# EAGLE design Root_v1.01 (EAGLE 7.6.0)
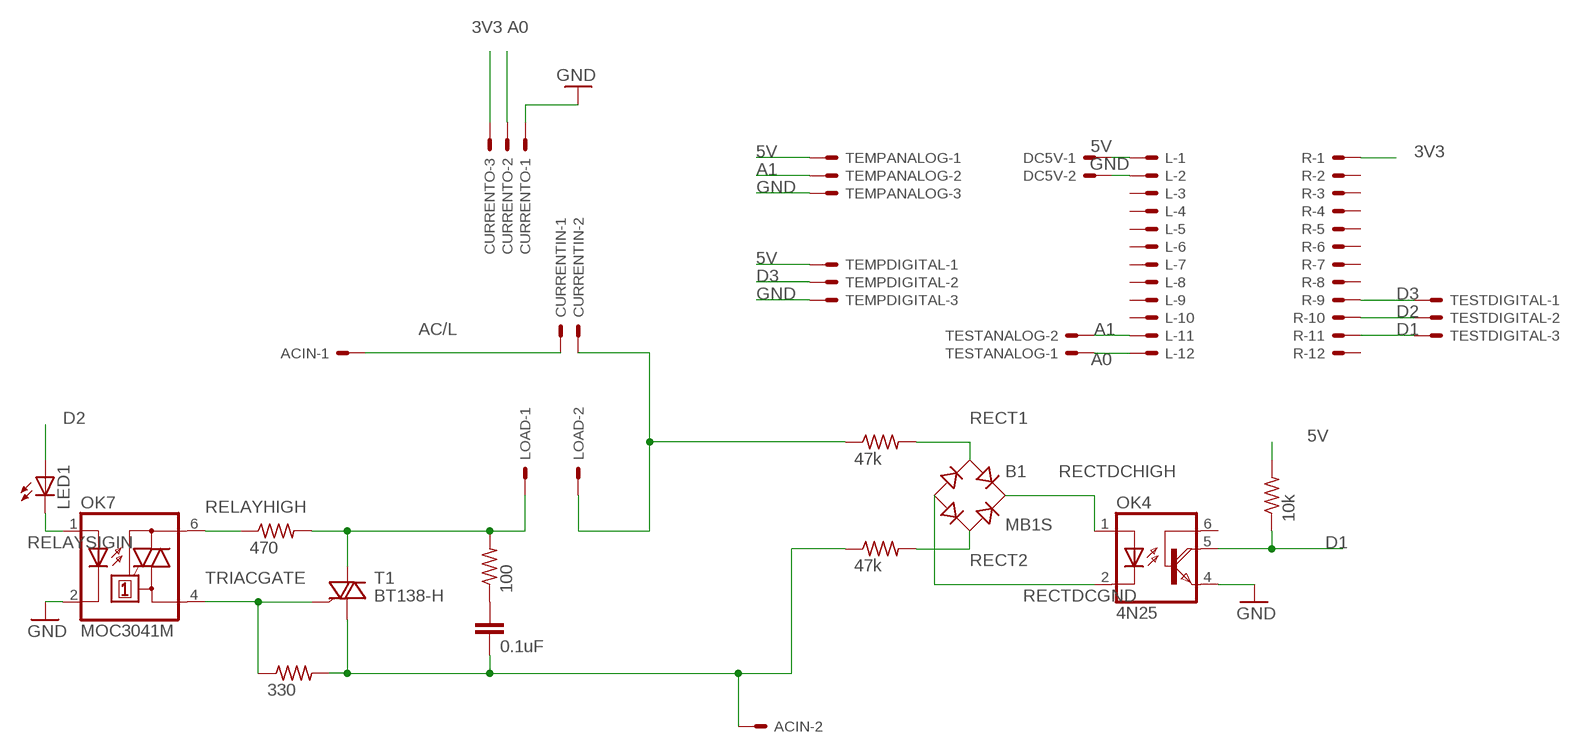
[diagram p0: schematic, sheet 1]

## Parts
ACIN  22-23-2021  [22-23-2021]
B1  MB1S  [SOIC-4]
C4  0.1uF  C5/3  [C5B3]
CURRENTIN  22-23-2021  [22-23-2021]
CURRENTO  22-23-2031  [22-23-2031]
DC5V  22-23-2021  [22-23-2021]
L  22-23-2121  [22-23-2121]
LED1  N/A  LED_ELD260  [LED_LD260]
LOAD  22-23-2021  [22-23-2021]
OK4  4N25  [DIL06]
OK7  MOC3041M  [DIL06]
R  22-23-2121  [22-23-2121]
R1  47k  R-US_0204/7  [0204/7]
R3  47k  R-US_0204/7  [0204/7]
R4  330  R-US_0204/7  [0204/7]
R6  100  R-US_0204/7  [0204/7]
R7  470  R-US_0204/7  [0204/7]
R8  10k  R-US_0204/7  [0204/7]
T1  BT138-H  [TO220BH]
TEMPANALOG  22-23-2031  [22-23-2031]
TEMPDIGITAL  22-23-2031  [22-23-2031]
TESTANALOG  22-23-2021  [22-23-2021]
TESTDIGITAL  22-23-2031  [22-23-2031]

## Nets
3V3: CURRENTO.3 R.1
5V: DC5V.1 L.1 R8.2 TEMPANALOG.1 TEMPDIGITAL.1
A0: CURRENTO.2 L.12 TESTANALOG.1
A1: L.11 TEMPANALOG.2 TESTANALOG.2
AC/L: ACIN.1 CURRENTIN.1
AC/N: ACIN.2 C4.2 R3.1 R4.2 T1.T1(A1)
D1: OK4.5(COL) R8.1 R.11 TESTDIGITAL.3
D2: LED1.A R.10 TESTDIGITAL.2
D3: R.9 TEMPDIGITAL.2 TESTDIGITAL.1
GND: CURRENTO.1 DC5V.2 L.2 OK4.4(E) OK7.2(C) TEMPANALOG.3 TEMPDIGITAL.3
LOAD/L: CURRENTIN.2 LOAD.2 R1.1
LOAD/N: LOAD.1 R6.2 R7.2 T1.T2(A2)
N$26: C4.1 R6.1
RECT1: B1.~1(AC1) R1.2
RECT2: B1.~2(AC2) R3.2
RECTDCGND: B1.- OK4.2(C)
RECTDCHIGH: B1.+ OK4.1(A)
RELAYHIGH: OK7.6(A2) R7.1
RELAYSIGIN: LED1.K(C) OK7.1(A)
TRIACGATE: OK7.4(A1) R4.1 T1.G
Unconnected: L.3 L.4 L.5 L.6 L.7 L.8 L.9 L.10 OK4.6(B) R.2 R.3 R.4 R.5 R.6 R.7 R.8 R.12

## Library data of the parts
ACIN CURRENTIN DC5V LOAD TESTANALOG = con-molex:22-23-2021: .100" (2.54mm) Center Header - 2 Pin; MF: MOLEX; MPN: 22-23-2021; OC_FARNELL: 1462926; OC_NEWARK: 25C3832
B1 = rectifier:MB*S: Bridge Rectifier Source: http://www.fairchildsemi.com/ds/MB/MB6S.pdf
C4 = capacitor-wima:C: CAPACITOR naming: grid - package width; C5: 0.1uF
CURRENTO TEMPANALOG TEMPDIGITAL TESTDIGITAL = con-molex:22-23-2031: .100" (2.54mm) Center Header - 3 Pin; MF: MOLEX; MPN: 22-23-2031; OC_FARNELL: 1462950; OC_NEWARK: 30C0862
L R = con-molex:22-23-2121: .100" (2.54mm) Center Header - 12 Pin; MF: MOLEX; MPN: 22-23-2121; OC_FARNELL: 1462935; OC_NEWARK: 56H0456
LED1 = eagle-ltspice:LED_E: LED Source: http://www.osram.convergy.de Source: www.luxeon.com Source: www.kingbright.com; SPICEMODEL: NONE; SPICEPREFIX: D; SPICETYPE: diode
OK4 = 4N25:4N25: Optocoupler, Phototransistor Output, With Base Connection VISHAY SEMICONDUCTORS created by Peter.Hofmann@ph-tronic.de <mailto:Reter.Hofmann@ph-tronic.de> 01-2006 Rev.0
OK7 = optocoupler:MOC30*: 6-Pin DIP Zero-Cross Optoisolators Triac Driver Output (250/400 Volt Peak) Source: Data sheet <http://www.fairchildsemi.com/ds/MO/MOC3031M.pdf> The old path of data sheet not more available 2013-05-06.; MF: FAIRCHILD SEMICONDUCTOR; MPN: MOC3041M; OC_FARNELL: 1086677; OC_NEWARK: 78K6090
R1 R3 = resistor:R-US_: RESISTOR, American symbol; R5: 47k
R4 = resistor:R-US_: RESISTOR, American symbol; R4: 330
R6 = resistor:R-US_: RESISTOR, American symbol; R5: 100
R7 = resistor:R-US_: RESISTOR, American symbol; R5: 470
R8 = resistor:R-US_: RESISTOR, American symbol; R5: 10k
T1 = triac:BT138: TRIAC Source: http://www.semiconductors.philips.com BT138_SERIES_2.pdf

## Board
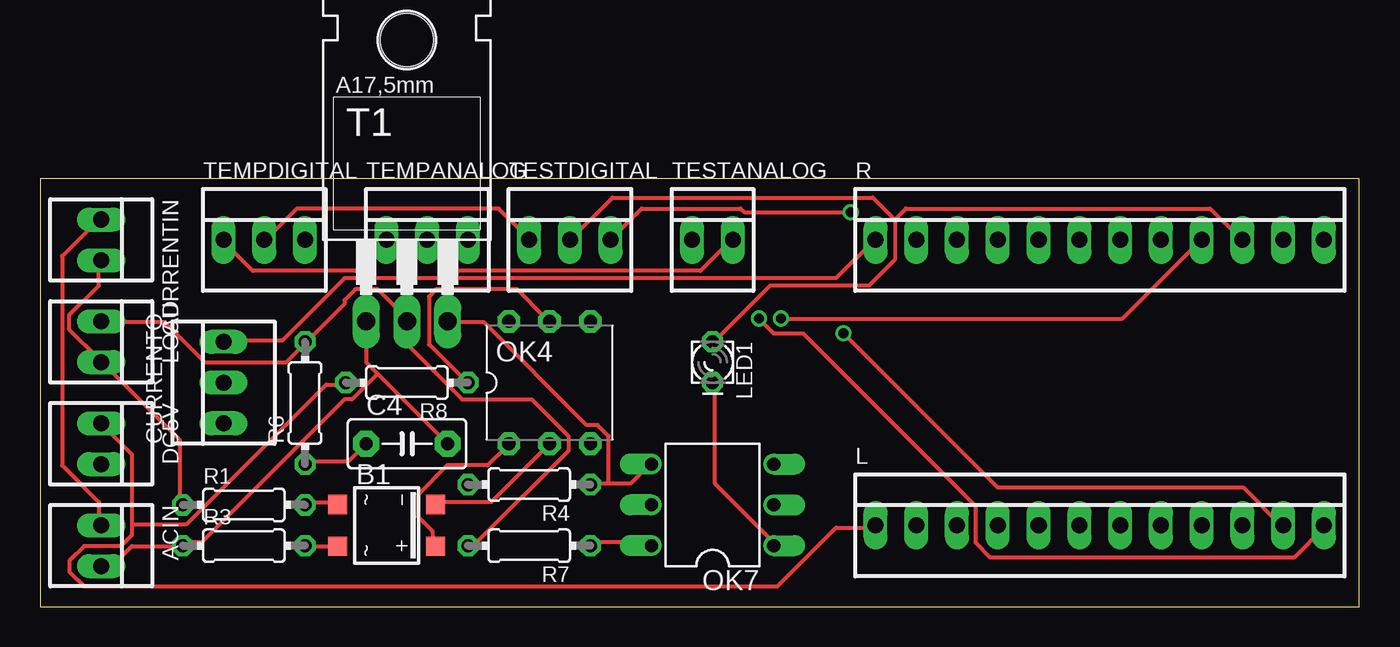
[diagram p1: board, top side]
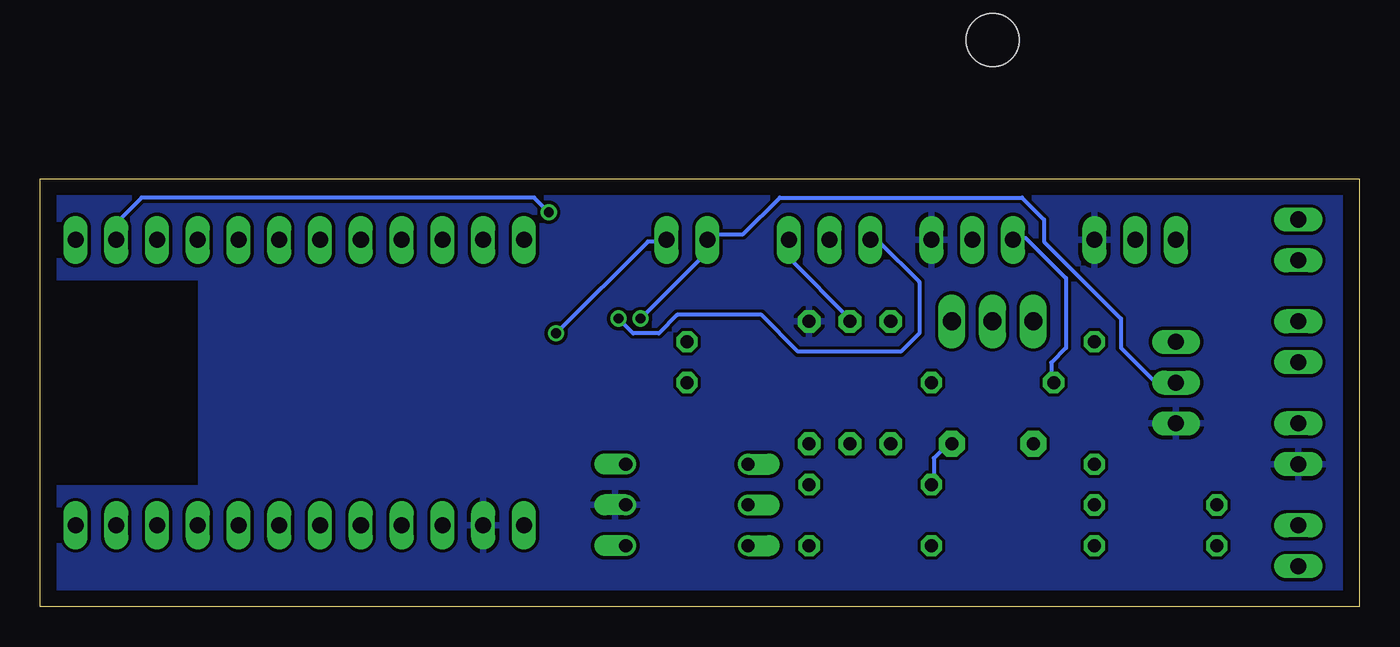
[diagram p2: board, bottom side, seen from below]

Size 82.22 x 26.66 mm. Coordinates in mm from the lower left corner, seen from the top.
Outline: 0,0 82.22,0 82.22,26.66 0,26.66 0,0
Copper layers (1*16): Top 0.035mm / dielectric 1.5mm / Bottom 0.035mm
Design rules "default": minimum track width 10mil, minimum drill 24mil, track to track 8mil, track to pad 8mil, pad to pad 8mil, via to via 8mil, smd to smd 8mil, copper to edge 40mil, drill to drill 8mil, minimum pad ring 10mil, minimum via ring 8mil, stop-mask expansion 4mil, vias tented up to drill 0mil, thermal gap 10mil
tRestrict: area 72.4,7.6 to 82.5,20.3
bRestrict: area 72.4,7.6 to 82.5,20.3

### Footprints (pad centres in the part's own frame; a part is rotated, then mirrored left to right if it is on the bottom)
22-23-2021 = drill 1 long: 1 -1.27,0; 2 1.27,0
SOIC-4 = smd 1.2 x 1.2: + 1.3,3.05; - -1.3,3.05; ~1 -1.3,-3.05; ~2 1.3,-3.05
C5B3 = drill 0.813 pad 1.6 octagon: 1 -2.54,0; 2 2.54,0
22-23-2031 = drill 1 long: 1 -2.54,0; 2 0,0; 3 2.54,0
22-23-2121 = drill 1 long: 1 -13.97,0; 2 -11.43,0; 3 -8.89,0; 4 -6.35,0; 5 -3.81,0; 6 -1.27,0; 7 1.27,0; 8 3.81,0; 9 6.35,0; 10 8.89,0; 11 11.43,0; 12 13.97,0
LED_LD260 = drill 0.813 octagon: A -1.27,0; K 1.27,0
DIL06 = drill 0.813 pad 1.422 octagon: 1 -2.54,-3.81; 2 0,-3.81; 3 2.54,-3.81; 4 2.54,3.81; 5 0,3.81; 6 -2.54,3.81
DIL06' = drill 0.813 offset: 1 -2.54,-3.81; 2 0,-3.81; 3 2.54,-3.81; 4 2.54,3.81; 5 0,3.81; 6 -2.54,3.81
0204/7 = drill 0.813 octagon: 1 -3.81,0; 2 3.81,0
TO220BH = drill 1.118 long: G 2.54,-6.35; T1 -2.54,-6.35; T2 0,-6.35 | hole 3.302: 0,11.176

### Placement (x,y rotation side)
ACIN  3.81,3.81 270 top
B1  21.59,5.08 270 top
C4  22.86,10.16 0 top
CURRENTIN  3.81,22.86 270 top
CURRENTO  11.43,13.97 90 top
DC5V  3.81,10.16 270 top
L  66.04,5.08 0 top
LED1  41.91,15.24 270 top
LOAD  3.81,16.51 270 top
OK4  31.75,13.97 0 top
OK7  MOC3041M  [DIL06']  41.91,6.35 90 top
R  66.04,22.86 0 top
R1  12.7,6.35 0 top
R3  12.7,3.81 0 top
R4  30.48,7.62 180 top
R6  16.51,12.7 90 top
R7  30.48,3.81 180 top
R8  22.86,13.97 180 top
T1  22.86,24.13 0 top
TEMPANALOG  24.13,22.86 0 top
TEMPDIGITAL  13.97,22.86 0 top
TESTANALOG  41.91,22.86 0 top
TESTDIGITAL  33.02,22.86 0 top

### Tracks (layer width: path | path; a pad name or v marks a point on that pad's centre or on a via)
3V3
  Top 0.254: CURRENTO.3 11.43,16.59 15.09,16.59 18.97,20.47 49.61,20.47 51.89,22.76 R.1
5V
  Top 0.254: TEMPANALOG.1 19.66,20.93 13.26,20.93 11.43,22.76 TEMPDIGITAL.1 | 5.71,5.16 5.71,9.5 3.89,11.33 DC5V.1 | 5.71,5.16 5.71,4.47 5.03,3.79 2.74,3.79 1.83,2.87 1.83,2.18 2.74,1.27 45.95,1.27 49.61,4.93 51.89,4.93 L.1 | 5.71,5.16 9.14,5.16 17.83,13.84 18.97,13.84 R8.2
  Bottom 0.254: R8.2 19.2,14.07 19.2,15.21 18.29,16.13 18.29,20.47 20.8,22.99 21.49,22.99 TEMPANALOG.1
A0  (via drill 0.61)
  Top 0.254: v44.81,17.96 45.72,17.04 47.55,17.04 58.29,6.3 58.29,4.01 59.21,3.1 78.18,3.1 80.01,4.93 L.12
  Bottom 0.254: CURRENTO.2 11.43,14.07 12.8,14.07 14.86,16.13 14.86,17.96 19.66,22.76 19.66,24.13 21.03,25.5 36.12,25.5 38.41,23.22 40.23,23.22 40.46,22.99 TESTANALOG.1 40.69,22.76 40.69,22.07 v44.81,17.96
A1  (via drill 0.61)
  Top 0.254: TEMPANALOG.2 26.06,20.93 41.15,20.93 42.98,22.76 TESTANALOG.2 | v50.06,17.04 59.66,7.44 74.98,7.44 77.27,5.16 L.11
  Bottom 0.254: v50.06,17.04 44.35,22.76 43.2,22.76 TESTANALOG.2
AC/L
  Top 0.254: ACIN.1 3.66,5.16 3.66,6.53 1.37,8.81 1.37,21.84 3.66,24.13 CURRENTIN.1
AC/N
  Top 0.254: ACIN.2 3.89,2.64 4.57,2.64 5.71,3.79 8.69,3.79 R3.1 8.91,4.01 10.06,4.01 18.97,12.93 19.43,12.93 21.03,14.53 | C4.2 21.03,14.53 | 21.03,14.53 20.34,15.21 20.34,17.73 T1.T1
  Bottom 0.254: R4.2 26.52,7.67 26.52,9.27 25.6,10.19 C4.2
D1  (via drill 0.61)
  Top 0.254: R8.1 26.52,14.07 24.23,16.36 24.23,19.33 24.69,19.79 29.72,19.79 31.55,17.96 OK4.5 | v50.52,24.59 43.89,24.59 43.66,24.82 37.49,24.82 35.66,22.99 TESTDIGITAL.3
  Bottom 0.254: TESTDIGITAL.3 35.43,22.76 35.43,21.61 31.77,17.96 OK4.5 | v50.52,24.59 51.44,25.5 75.89,25.5 77.27,24.13 77.27,22.99 R.11
D2
  Top 0.254: 53.26,24.13 53.26,21.61 51.66,20.02 45.49,20.02 42.06,16.59 LED1.A | 53.26,24.13 51.89,25.5 35.66,25.5 TESTDIGITAL.2 | 53.26,24.13 53.95,24.82 72.92,24.82 74.75,22.99 R.10
D3  (via drill 0.61)
  Top 0.254: TEMPDIGITAL.2 14.17,22.99 16,24.82 28.57,24.82 30.4,22.99 TESTDIGITAL.1 | v46.18,17.96 67.44,17.96 72.24,22.76 R.9
  Bottom 0.254: v46.18,17.96 45.26,17.04 43.66,17.04 42.52,18.19 37.26,18.19 34.98,15.9 28.57,15.9 27.43,17.04 27.43,20.24 29.95,22.76 30.4,22.76 TESTDIGITAL.1
GND
  pour Bottom: 0,26.67 0,0 82.55,0 82.55,26.67
LOAD/L
  Top 0.254: R1.1 8.69,6.53 8.69,10.41 3.89,15.21 LOAD.2 3.66,15.44 1.83,17.27 1.83,18.19 3.66,20.02 3.66,21.39 CURRENTIN.2
LOAD/N
  Top 0.254: R7.2 26.75,4.01 27.2,4.01 32.92,9.73 32.92,10.64 30.63,12.93 26.29,12.93 22.86,16.36 T1.T2 22.86,17.96 21.03,19.79 19.66,19.79 18.97,19.1 18.97,18.87 16.69,16.59 R6.2 16.46,16.36 15.32,15.21 10.29,15.21 7.77,17.73 3.89,17.73 LOAD.1
N$26
  Top 0.254: C4.1 19.2,9.04 16.69,9.04 R6.1
RECT1
  Top 0.254: B1.~1 18.52,6.53 16.69,6.53 R1.2
RECT2
  Top 0.254: B1.~2 18.52,3.79 16.69,3.79 R3.2
RECTDCGND
  Top 0.254: OK4.2 28.12,6.53 24.69,6.53 B1.-
RECTDCHIGH
  Top 0.254: B1.+ 24.46,3.79 24.46,4.7 23.55,5.61 23.55,6.99 25.38,8.81 27.89,8.81 29.03,9.96 OK4.1
RELAYHIGH
  Top 0.254: R7.1 34.29,4.01 37.95,4.01 OK7.6
RELAYSIGIN
  Top 0.254: LED1.K 42.06,13.84 42.06,7.67 45.72,4.01 OK7.1
TRIACGATE
  Top 0.254: 35.43,7.67 36.8,7.67 37.95,8.81 OK7.4 | 35.43,7.67 34.29,7.67 R4.1 | 35.43,7.67 35.43,10.64 34.75,11.33 34.06,11.33 27.66,17.73 25.6,17.73 T1.G